# Altium schematic sheet [03] ESP32.SchDoc
size A4; SheetNumber: 3; SheetTotal: 6
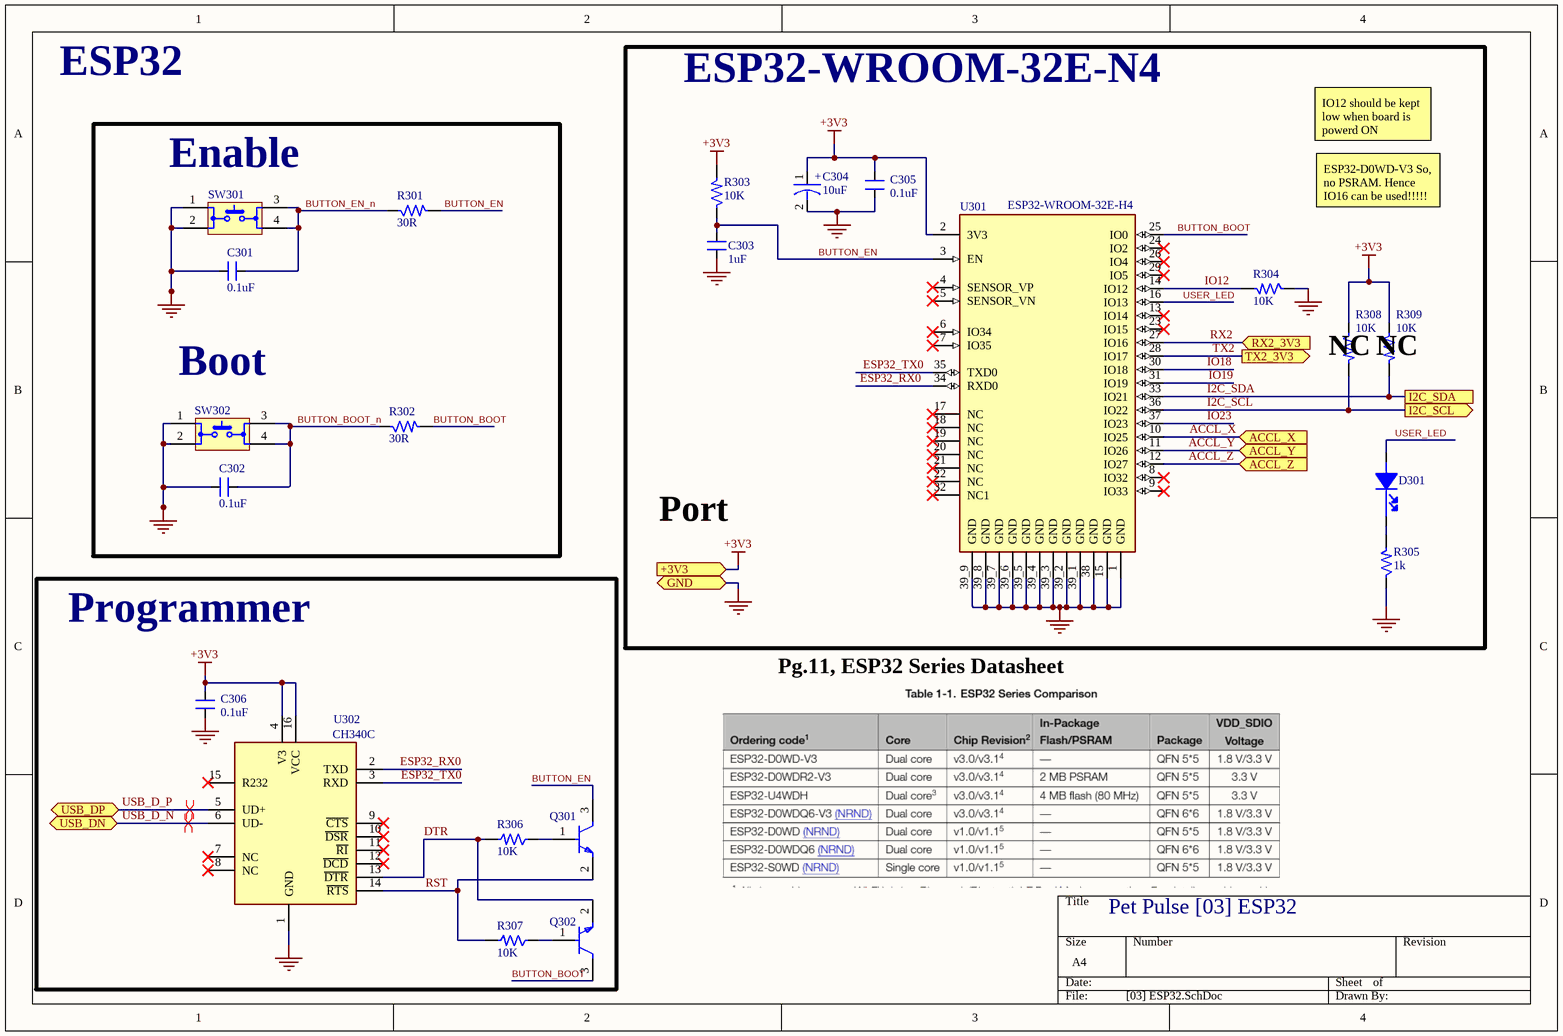
[diagram p0: [03] ESP32.SchDoc]

## Parts
C301  0.1uF  [CAP_0805]
C302  0.1uF  [CAP_0805]
C303  1uF  [CAP_0805]
C304  10uF  [CAP-T_1206]
C305  0.1uF  [CAP_0805]
C306  0.1uF  [CAP_0805]
D301  LED 0805 ORANGE  [LED_0805]  (value not drawn)
Q301  MMBT3904-7-F  [FP-SOT23-MFG]  (value not drawn)
Q302  MMBT3904-7-F  [FP-SOT23-MFG]  (value not drawn)
R301  30R  [RES_0805]
R302  30R  [RES_0805]
R303  10K  [RES_0805]
R304  10K  [RES_0805]
R305  1k  [RES_0805]
R306  10K  [RES_0805]
R307  10K  [RES_0805]
R308  10K  [RES_0805]
R309  10K  [RES_0805]
SW301  SW1_SMD_TL3305AF260QG  [SW_TL3305AF260QG]  (value not drawn)
SW302  SW1_SMD_TL3305AF260QG  [SW_TL3305AF260QG]  (value not drawn)
U301  ESP32-WROOM-32E-H4  [MOD_ESP32-WROOM-32E_(4MB_HIGH_TEMP)]
U302  CH340C  [SOIC16_50_284_25X90_SMT]

## Blocks framed on the sheet
ESP32-WROOM-32E-N4: C303-C305 D301 R303-R305 R308 R309 U301
Programmer: C306 Q301 Q302 R306 R307 U302

## Ports
+3V3 (in, see [02] LDO and LiPo Circuit[4A], [04] GPS[4A], [05] External Modules[4A], [06] LTE - A7670C[8A]), ACCL_X (in, see [05] External Modules[2B]), ACCL_Y (in, see [05] External Modules[2B]), ACCL_Z (in, see [05] External Modules[2B]), GND (bidir, see [02] LDO and LiPo Circuit[4A], [04] GPS[4A], [05] External Modules[4A], [06] LTE - A7670C[8A]), I2C_SCL (out, see [04] GPS[1B], [05] External Modules[3B]), I2C_SDA (see [04] GPS[1B], [05] External Modules[3B]), RX2_3V3 (in, see [06] LTE - A7670C[6B]), TX2_3V3 (out, see [06] LTE - A7670C[6B]), USB_DN (bidir, see [02] LDO and LiPo Circuit[1A]), USB_DP (bidir, see [02] LDO and LiPo Circuit[1A])

## Nets
+3V3: C304.1 C305.2 C306.2 R303.2 R308.1 R309.1 U301.2(3V3) U302.4(V3) U302.16(VCC) ; port +3V3
GND: C301.2 C302.2 C303.1 C304.2 C305.1 C306.1 R304.1 R305.1 SW301.1 SW301.2 SW302.1 SW302.2 U301.1(GND) U301.15(GND) U301.38(GND) U301.39_1(GND) U301.39_2(GND) U301.39_3(GND) U301.39_4(GND) U301.39_5(GND) U301.39_6(GND) U301.39_7(GND) U301.39_8(GND) U301.39_9(GND) U302.1(GND) ; port GND
ACCL_X: U301.10(IO25) ; port ACCL_X
ACCL_Y: U301.11(IO26) ; port ACCL_Y
ACCL_Z: U301.12(IO27) ; port ACCL_Z
BUTTON_BOOT: Q302.3(C) R302.2 U301.25(IO0)
BUTTON_BOOT_n: C302.1 R302.1 SW302.3 SW302.4
BUTTON_EN: C303.2 Q301.3(C) R301.2 R303.1 U301.3(EN)
BUTTON_EN_n: C301.1 R301.1 SW301.3 SW301.4
DTR: Q302.2(E) R306.2 U302.13(~{DTR})
ESP32_RX0: U301.34(RXD0) U302.2(TXD)
ESP32_TX0: U301.35(TXD0) U302.3(RXD)
I2C_SCL: R308.2 U301.36(IO22) ; port I2C_SCL
I2C_SDA: R309.2 U301.33(IO21) ; port I2C_SDA
IO12: R304.2 U301.14(IO12)
IO18: U301.30(IO18)
IO19: U301.31(IO19)
IO23: U301.37(IO23)
RST: Q301.2(E) R307.2 U302.14(~{RTS})
RX2: U301.27(IO16) ; port RX2_3V3
TX2: U301.28(IO17) ; port TX2_3V3
USB_D_N: U302.6(UD-) ; port USB_DN
USB_D_P: U302.5(UD+) ; port USB_DP
USER_LED: D301.2(Anode) U301.16(IO13)
NetD301_1: D301.1(Cathode) R305.2
NetQ301_1: Q301.1(B) R306.1
NetQ302_1: Q302.1(B) R307.1

Not connected (* = marked no-connect by the designer): U301 4(SENSOR_VP)* 5(SENSOR_VN)* 6(IO34)* 7(IO35)* 8(IO32)* 9(IO33)* 13(IO14)* 17(NC)* 18(NC)* 19(NC)* 20(NC)* 21(NC)* 22(NC)* 23(IO15)* 24(IO2)* 26(IO4)* 29(IO5)* 32(NC1)*; U302 7(NC)* 8(NC)* 9(~{CTS})* 10(~{DSR})* 11(~{RI})* 12(~{DCD})* 15(R232)*

## Layout directives
differential pair; differential pair class DIFF90: USB_D_N, USB_D_P

## Notes on the sheet
- ESP32
- (near SW301) Enable
- IO12 should be kept low when board is powerd ON
- ESP32-D0WD-V3 So, no PSRAM. Hence IO16 can be used!!!!!
- (near SW302) Boot
- (near R308) NC
- (near R309) NC
- Port
- Pg.11, ESP32 Series Datasheet
- Pet Pulse [03] ESP32
- (in symbol CAP-P_10uF-16V-10%-1206) +

## Library data of the parts
C301 C302 C305 C306 = CAP_0.1uF-50V-10%-0805: 0.1µF ±10% 50V Ceramic Capacitor X7R 0805 (2012 Metric); Manufacturer: Samsung; Manufacturer Part Number: CL21B104KBCNNNC; Alternate Part Number-1: NA; Case/Package: 0805; Supplier-1: SIRICOM; Supplier Part Number-1: 0805B104K500CT
C303 = CAP_1uF-50V-5%-0805: 1µF ±5% 50V Ceramic Capacitor X7R 0805 (2012 Metric); Manufacturer: Samsung; Manufacturer Part Number: CC0805JKX7R9BB105; Alternate Part Number-1: 0805F105M500NT; Case/Package: 0805; Supplier-1: SIRICOM; Supplier Part Number-1: CL21B105KBFNNNE
C304 = CAP-P_10uF-16V-10%-1206: 10µF Molded Tantalum Capacitors 16V 1206 (3216 Metric) 3Ohm; Manufacturer: AVX Corporation; Manufacturer Part Number: TAJA106K016SNJ; Alternate Part Number-1: CA45-A016K106T; Case/Package: 1206; Supplier-1: SIRICOM; Supplier Part Number-1: TAJA106K016SNJ
D301 = LED_ORANGE-2V-20mA- 0805: Orange LED 0805 Vf = 2V, 20mA; Manufacturer: Osram Opto; Manufacturer Part Number: LOR976-PS-1; Lens Color: White; Viewing Angle: 160°; Lens Style: Flat,Rectangular,Diffused,Colorless; Forward Current: 25mA; Luminous Intensity: 162.5mcd; Dominant Wavelength: 606nm; Luminous Flux: 0.735lm; Reverse Voltage: 12V; Lens Transparency: Diffused; Number of LEDs: 1; Lens Size: 1.25mm; Supplier 1: Arrow Electronics; RoHS: Yes; Category: LEDs; Stock 1: 2418; Pricing 1: 1=0.27100, 10=0.15400, 25=0.15270, 100=0.07290, 250=0.07210, 500=0.06600, 1000=0.05150 (USD); Mount: Surface Mount; Case/Package: 0805; Number of Pins: 2; Color: Orange; Case Code (Metric): 2012; Case Code (Imperial): 0805; Contact Plating: Tin,Matte; Min Operating Temperature: -30°C; Max Operating Temperature: 85°C; Packaging: Tape and Reel; Forward Voltage: 2V; Test Current: 20mA; Package Quantity: 16000; Illumination Color: Orange; Series: CHIPLED 0805; Length: 2mm; Width: 1.25mm; Height: 0.9mm; Radiation Hardening: No; RoHS Compliant: Yes; ComponentLink1URL: https://datasheet.ciiva.com/2119/00078881-0-2119287.pdf?src-supplier=Digi-Key; ComponentLink1Description: https://datasheet.ciiva.com/2119/00078881-0-2119287.pdf?src-supplier=Digi-Key; ComponentLink2URL: https://datasheet.ciiva.com/2119/00078881-0-2119286.pdf?src-supplier=Digi-Key; ComponentLink2Description: https://datasheet.ciiva.com/2119/00078881-0-2119286.pdf?src-supplier=Digi-Key; ComponentLink3URL: https://datasheet.ciiva.com/2119/00078881-0-2119288.pdf?src-supplier=Digi-Key; ComponentLink3Description: https://datasheet.ciiva.com/2119/00078881-0-2119288.pdf?src-supplier=Digi-Key; Supplier Part Number 1: LO R976-PS-1
Q301 Q302 = TRANS_NPN_MMBT3904: TRANS NPN 40V 0.2A SMD SOT23-3; Manufacturer: Diodes Incorporated; Frequency: 300MHz; Power Dissipation: 350mW; Element Configuration: Single; Max Power Dissipation: 300mW; Max Collector Current: 200mA; Collector Emitter Saturation Voltage: 300mV; Number of Elements: 1; hFE Min: 100; Collector Base Voltage (VCBO): 60V; Emitter Base Voltage (VEBO): 6V; Contact Plating: Tin; Package Quantity: 3000; Max Frequency: 300MHz; REACH SVHC: No SVHC; Max Operating Temperature: 150°C; Width: 1.4mm; Collector Emitter Voltage (VCEO): 40V; Voltage Rating (DC): 40V; Radiation Hardening: No; Case/Package: SOT-23; Height: 1mm; Collector Emitter Breakdown Voltage: 40V; Length: 3.05mm; Polarity: NPN; Packaging: Tape and Reel; Number of Pins: 3; Min Operating Temperature: -55°C; Gain Bandwidth Product: 300MHz; Mount: Surface Mount; Weight: 0.000282oz; Continuous Collector Current: 200mA; Transition Frequency: 300MHz; Max Breakdown Voltage: 40V; Lead Free: Lead Free; Manufacturer Part Number: MMBT3904-7-F
R301 R302 = RES_30R-0.125W-5%-0805: 30 Ohms ±5% 0.125W, 1/8W Chip Resistor 0805 (2012 Metric) Moisture Resistant Thick Film; Manufacturer: Stackpole Electronics; Manufacturer Part Number: RC0805JR-0730RL; Alternate Part Number-1: NA; Case/Package: 0805; Supplier-1: SIRICOM; Supplier Part Number-1: WR08X30R0FTL
R303 R304 R306-R309 = RES_10K-0.125W-1%-0805: 10 kOhms ±1% 0.125W, 1/8W Chip Resistor 0805 (2012 Metric) Automotive AEC-Q200 Thick Film; Manufacturer: CTS; Manufacturer Part Number: WR08X1002FTL; Case/Package: 0805; Supplier-1: SIRICOM; Supplier Part Number-1: WR08X1002FTL; Alternate Part Number-1: WR08X1002FTL
R305 = RES_1K- 0.125W-5%-0805: RES 1K OHM 5% 1/8W 0805; Manufacturer Part Number: RC0805JR-131KL; Manufacturer: YAGEO; Alternate Part Number: NA; Case/Package: 0805
SW301 SW302 = SW1_SMD_TL3305AF260QG: Tactile Switch SPST SMD; Manufacturer: E-Switch; Manufacturer Part Number: TL3305AF260QG; Case/Package: SMD
U301 = MOD-ESP32-WROOM-32E-H4: Rx Txrx Mod Wifi Trace Ant SMD; Manufacturer: Espressif Systems; Supplier 1: Digi-Key; Manufacturer Part Number: ESP32-WROOM-32E-H4; RoHS: No; Category: Uncategorized; Stock 1: 12159; Pricing 1: 1=3.15000 (USD); Supplier Part Number 1: 1965-ESP32-WROOM-32E-H4CT-ND
U302 = IC_CH340C: USB Bridge, USB to UART USB 2.0 UART Interface; Manufacturer: Olimex; Alternate Part Number-1: NA; Manufacturer Part Number: CH340C; Case/Package: SOIC16; Supplier-1: LCSC; Supplier Part Number-1: C84681